# EAGLE schematic H00R2 (EAGLE 9.6.1)
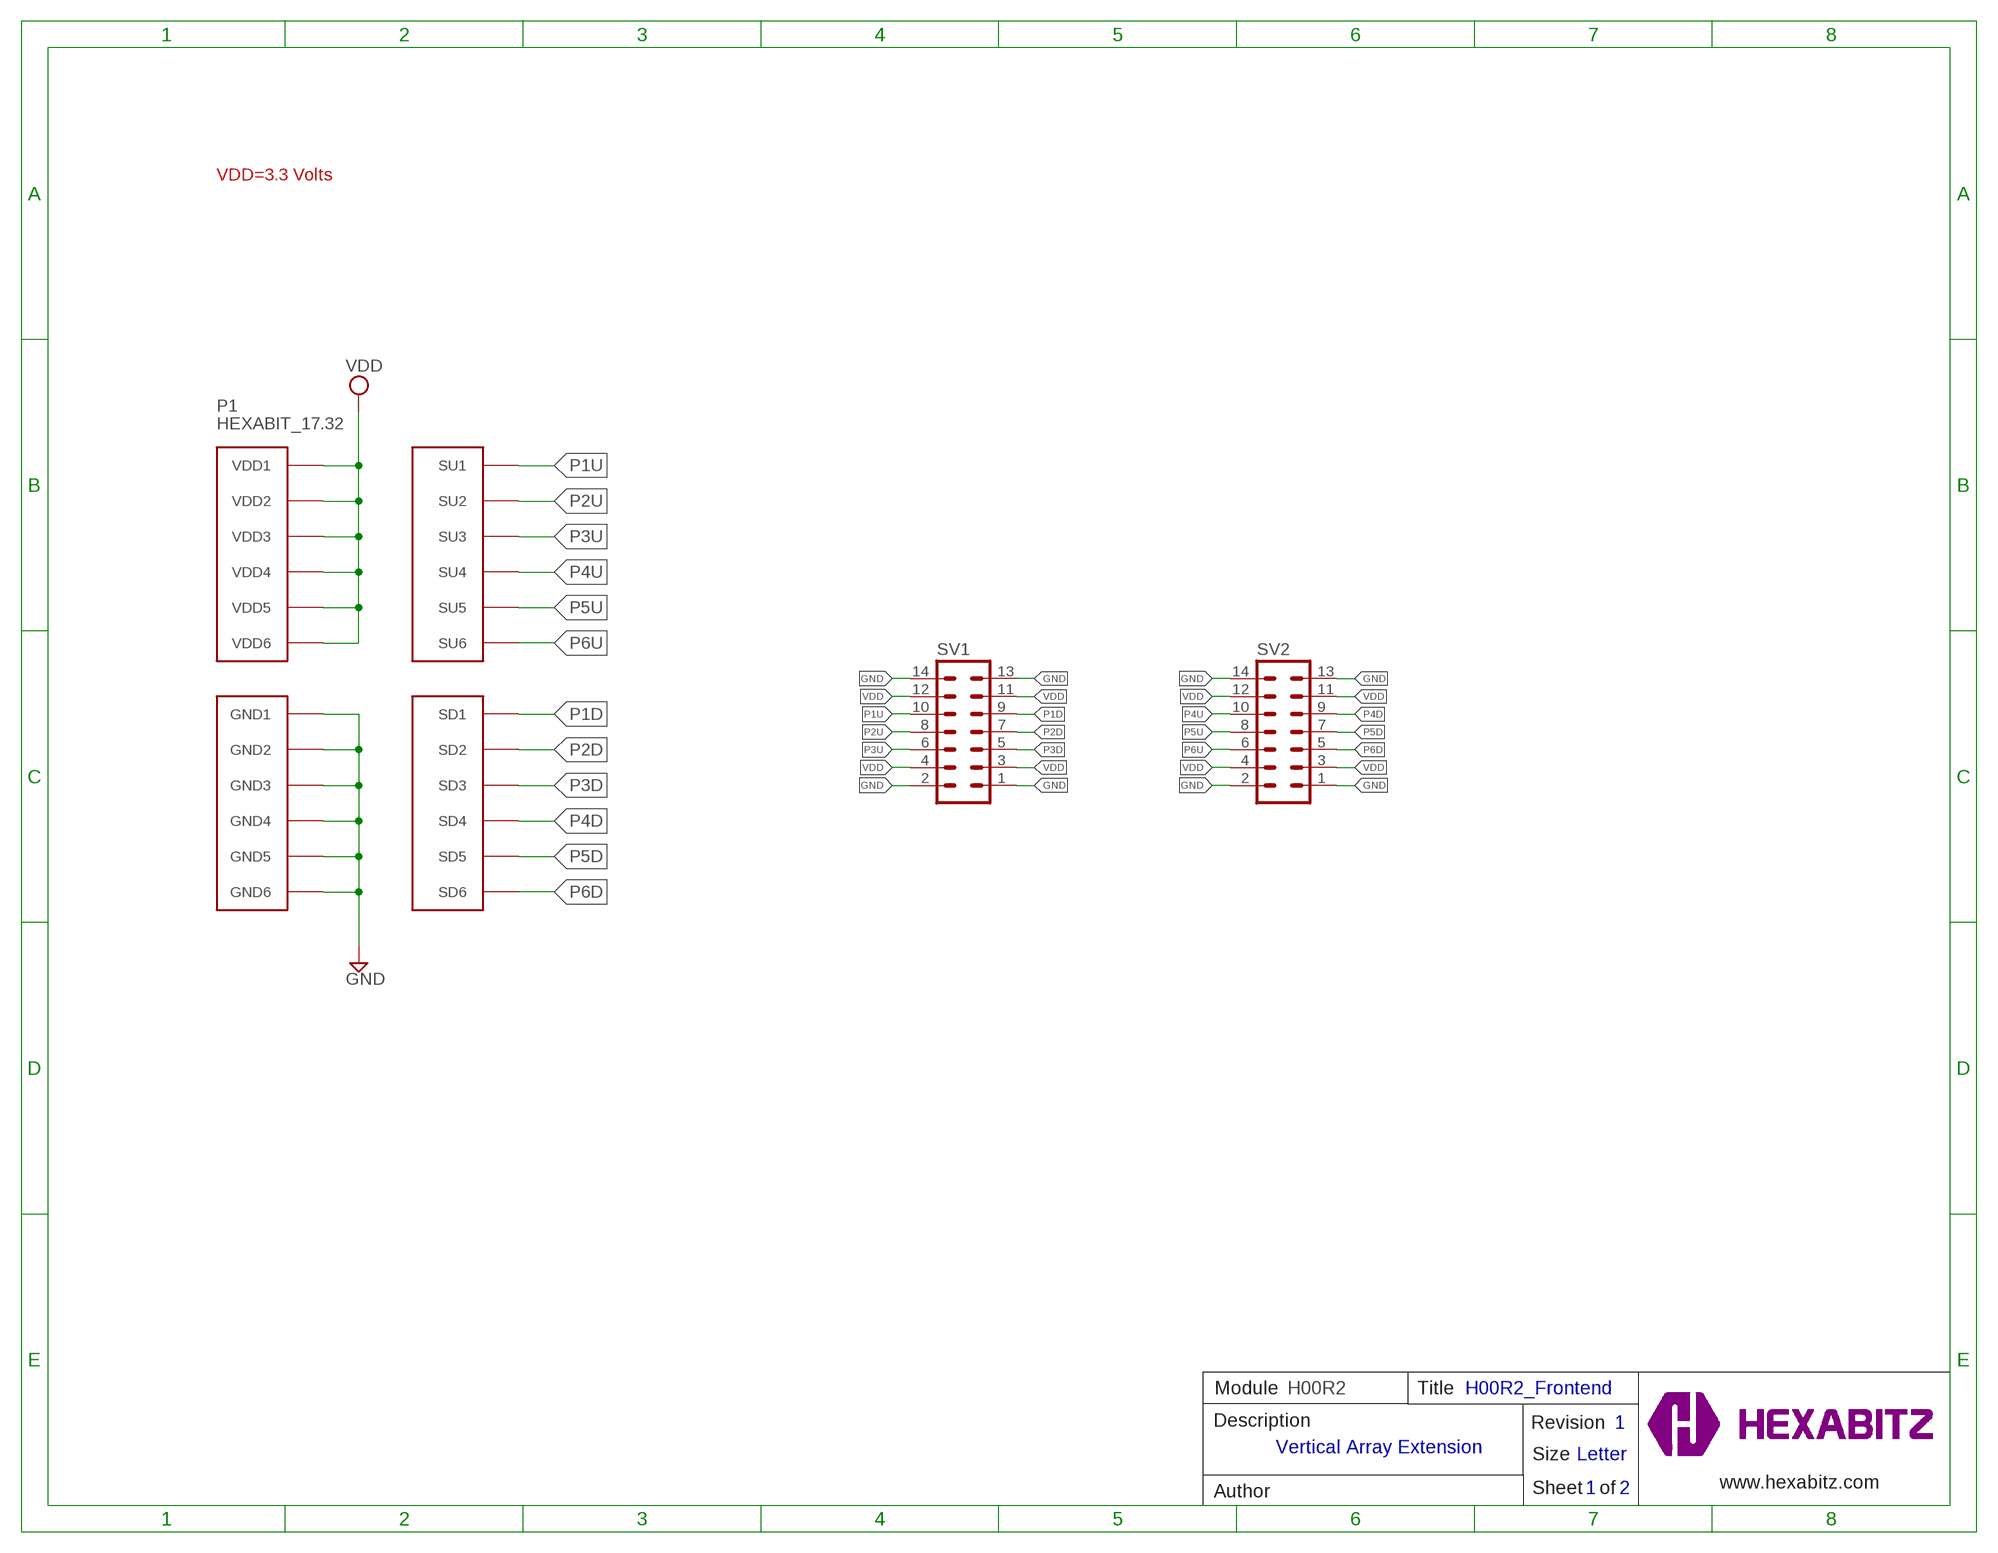
[diagram p0: schematic, sheet 1]

## Parts
P1  HEXABIT_17.32  [HEXABIT_17.32]
SV1  MA07-2  [MA07-2]
SV2  MA07-2  [MA07-2]
TRIMBLE-LOGO1  HEXA-LOGO  [HEXA-LOGO]

## Nets
GND: P1.PAD_PD7(GND1) P1.PAD_PD8(GND2) P1.PAD_PD9(GND3) P1.PAD_PD10(GND4) P1.PAD_PD11(GND5) P1.PAD_PD12(GND6) SV1.1 SV1.2 SV1.13 SV1.14 SV2.1 SV2.2 SV2.13 SV2.14
P1D: P1.PAD_PD1(SD1) SV1.9
P1U: P1.PAD_PU1(SU1) SV1.10
P2D: P1.PAD_PD2(SD2) SV1.7
P2U: P1.PAD_PU2(SU2) SV1.8
P3D: P1.PAD_PD3(SD3) SV1.5
P3U: P1.PAD_PU3(SU3) SV1.6
P4D: P1.PAD_PD4(SD4) SV2.9
P4U: P1.PAD_PU4(SU4) SV2.10
P5D: P1.PAD_PD5(SD5) SV2.7
P5U: P1.PAD_PU5(SU5) SV2.8
P6D: P1.PAD_PD6(SD6) SV2.5
P6U: P1.PAD_PU6(SU6) SV2.6
VDD: P1.PAD_PU7(VDD1) P1.PAD_PU8(VDD2) P1.PAD_PU9(VDD3) P1.PAD_PU10(VDD4) P1.PAD_PU11(VDD5) P1.PAD_PU12(VDD6) SV1.3 SV1.4 SV1.11 SV1.12 SV2.3 SV2.4 SV2.11 SV2.12

## Notes on the sheet
- VDD=3.3 Volts
- Module | H00R2 | Title | H00R2_Frontend
- Description | Revision | 1
- Vertical Array Extension
- Size | Letter
- www.hexabitz.com
- Author | Sheet   of | 1 | 2

## Library data of the parts
P1 = hexabitz_connectors:HEXABIT_?: Hexabitz Hexagon Module Connector Hexagon side length = 17.32mm.
SV1 SV2 = Hexabitz:MA07-2: PIN HEADER; OC_FARNELL: unknown; OC_NEWARK: unknown
TRIMBLE-LOGO1 = HEXABITZ_USER_INTERFACE_PARTS:HEXA-LOGO: Trimble-Logo